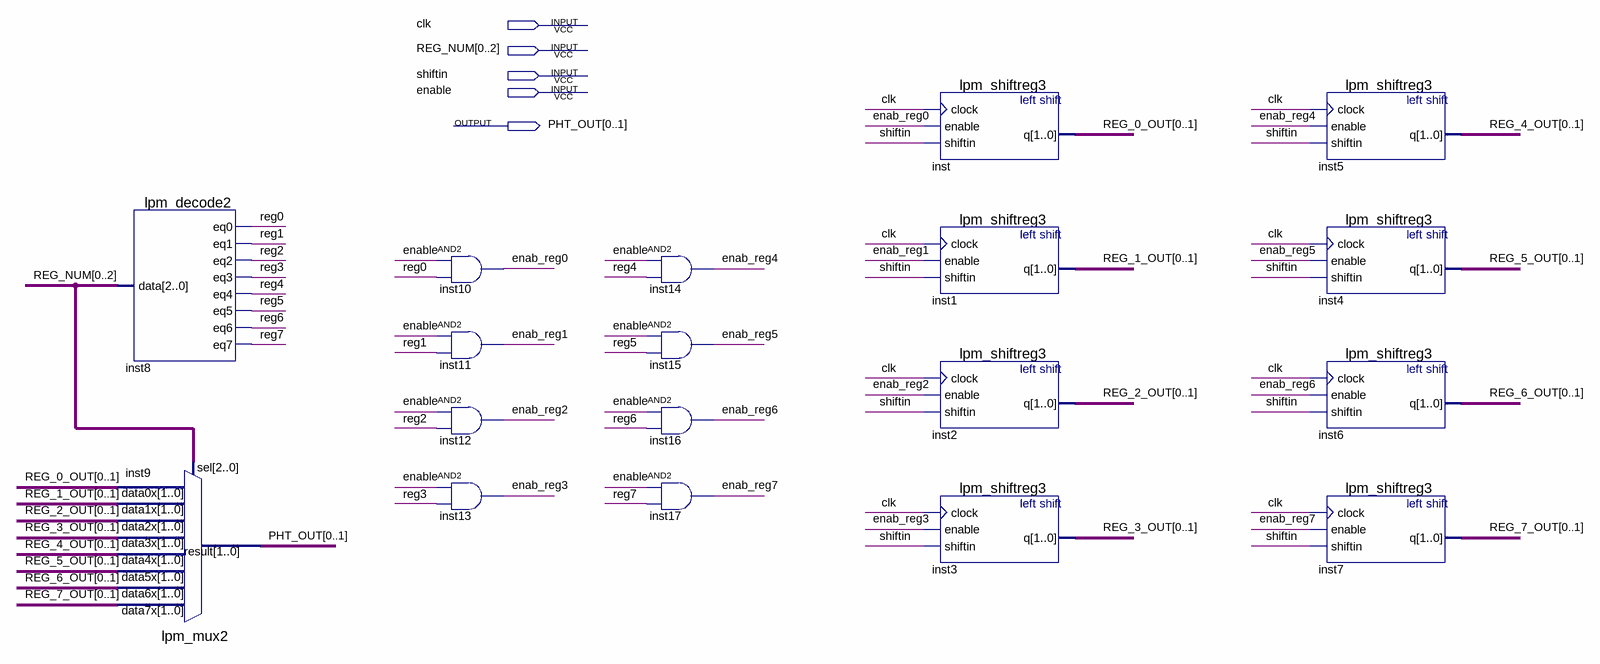
[diagram p0: schematic sheet]
// Quartus schematic PHT.bdf as structural Verilog: 18 symbols, 5 pins
module PHT (
  input  clk,
  input  [0:2] REG_NUM,
  input  shiftin,
  input  enable,
  output [0:1] PHT_OUT
);

  wire enab_reg0, enab_reg1, enab_reg2, enab_reg3, enab_reg4, enab_reg5, enab_reg6, enab_reg7, reg0, reg1,
       reg2, reg3, reg4, reg5, reg6, reg7;
  wire [1:0] REG_0_OUT, REG_1_OUT, REG_2_OUT, REG_3_OUT, REG_4_OUT, REG_5_OUT, REG_6_OUT, REG_7_OUT;

  lpm_decode2 inst8 (
    .data(REG_NUM), .eq0(reg0), .eq1(reg1), .eq2(reg2), .eq3(reg3), .eq4(reg4), .eq5(reg5), .eq6(reg6),
    .eq7(reg7));
  lpm_mux2 inst9 (
    .data7x({REG_7_OUT[0], REG_7_OUT[1]}), .data6x({REG_6_OUT[0], REG_6_OUT[1]}),
    .data5x({REG_5_OUT[0], REG_5_OUT[1]}), .data4x({REG_4_OUT[0], REG_4_OUT[1]}),
    .data3x({REG_3_OUT[0], REG_3_OUT[1]}), .data2x({REG_2_OUT[0], REG_2_OUT[1]}),
    .data1x({REG_1_OUT[0], REG_1_OUT[1]}), .data0x({REG_0_OUT[0], REG_0_OUT[1]}), .sel(REG_NUM),
    .result(PHT_OUT));
  and inst10 (enab_reg0, enable, reg0);
  and inst11 (enab_reg1, enable, reg1);
  and inst12 (enab_reg2, enable, reg2);
  and inst13 (enab_reg3, enable, reg3);
  and inst14 (enab_reg4, enable, reg4);
  and inst15 (enab_reg5, enable, reg5);
  and inst16 (enab_reg6, enable, reg6);
  and inst17 (enab_reg7, enable, reg7);
  lpm_shiftreg3 inst (.clock(clk), .enable(enab_reg0), .shiftin(shiftin), .q({REG_0_OUT[0], REG_0_OUT[1]}));
  lpm_shiftreg3 inst1 (.clock(clk), .enable(enab_reg1), .shiftin(shiftin), .q({REG_1_OUT[0], REG_1_OUT[1]}));
  lpm_shiftreg3 inst2 (.clock(clk), .enable(enab_reg2), .shiftin(shiftin), .q({REG_2_OUT[0], REG_2_OUT[1]}));
  lpm_shiftreg3 inst3 (.clock(clk), .enable(enab_reg3), .shiftin(shiftin), .q({REG_3_OUT[0], REG_3_OUT[1]}));
  lpm_shiftreg3 inst5 (.clock(clk), .enable(enab_reg4), .shiftin(shiftin), .q({REG_4_OUT[0], REG_4_OUT[1]}));
  lpm_shiftreg3 inst4 (.clock(clk), .enable(enab_reg5), .shiftin(shiftin), .q({REG_5_OUT[0], REG_5_OUT[1]}));
  lpm_shiftreg3 inst6 (.clock(clk), .enable(enab_reg6), .shiftin(shiftin), .q({REG_6_OUT[0], REG_6_OUT[1]}));
  lpm_shiftreg3 inst7 (.clock(clk), .enable(enab_reg7), .shiftin(shiftin), .q({REG_7_OUT[0], REG_7_OUT[1]}));
endmodule
